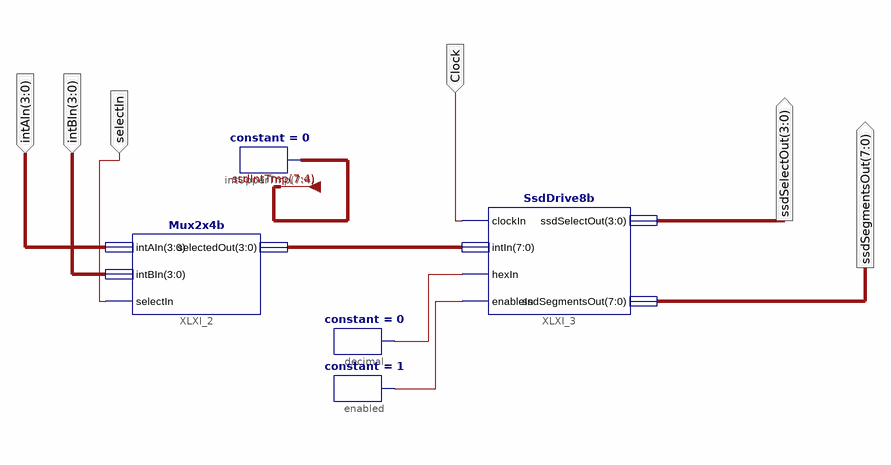
[diagram p0: schematic sheet 1]
// Xilinx ISE schematic Experiment5.sch (spartan3e) as structural Verilog: 5 symbols, 6 ports
module Experiment5 (
  input  selectIn,
  input  [3:0] intBIn,
  input  [3:0] intAIn,
  input  Clock,
  output [3:0] ssdSelectOut,
  output [7:0] ssdSegmentsOut
);

  wire XLXN_29, XLXN_30;
  wire [3:0] XLXN_24;
  wire [7:4] ssdIntTmp;

  Mux2x4b XLXI_2 (.intAIn(intAIn), .intBIn(intBIn), .selectIn(selectIn), .selectedOut(XLXN_24));
  constant #(.CValue("0")) intUpperTmp[7:4] (.O(ssdIntTmp));
  constant #(.CValue("0")) decimal (.O(XLXN_29));
  constant #(.CValue("1")) enabled (.O(XLXN_30));
  SsdDrive8b XLXI_3 (
    .clockIn(Clock), .intIn(XLXN_24), .hexIn(XLXN_29), .enableIn(XLXN_30), .ssdSelectOut(ssdSelectOut),
    .ssdSegmentsOut(ssdSegmentsOut));
endmodule
